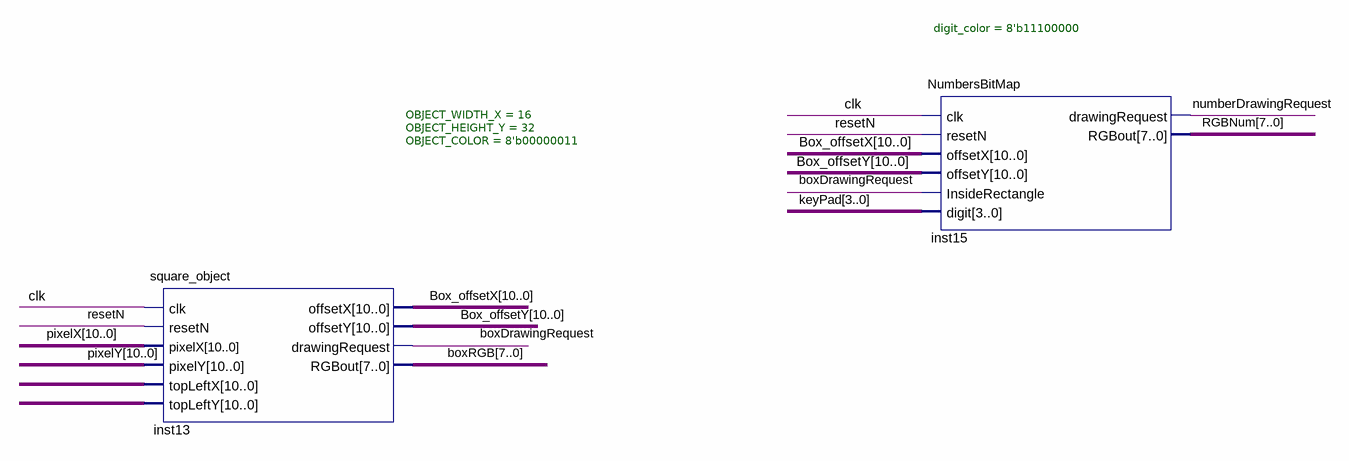
[diagram p0: schematic sheet]
// Quartus schematic slingShotBlock.bdf as structural Verilog: 2 symbols, 0 pins
module slingShotBlock (
);

  wire boxDrawingRequest, clk, numberDrawingRequest, resetN;
  wire [3:0] keyPad;
  wire [7:0] boxRGB, RGBNum;
  wire [10:0] Box_offsetX, Box_offsetY, pixelX, pixelY, undriven, undriven_2;

  square_object #(.OBJECT_WIDTH_X(16), .OBJECT_HEIGHT_Y(32), .OBJECT_COLOR(8'b00000011)) inst13 (
    .clk(clk), .resetN(resetN), .pixelX(pixelX), .pixelY(pixelY), .topLeftX(undriven), .topLeftY(undriven_2),
    .offsetX(Box_offsetX), .offsetY(Box_offsetY), .drawingRequest(boxDrawingRequest), .RGBout(boxRGB));
  NumbersBitMap #(.digit_color(8'b11100000)) inst15 (
    .clk(clk), .resetN(resetN), .offsetX(Box_offsetX), .offsetY(Box_offsetY),
    .InsideRectangle(boxDrawingRequest), .digit(keyPad), .drawingRequest(numberDrawingRequest),
    .RGBout(RGBNum));
endmodule
